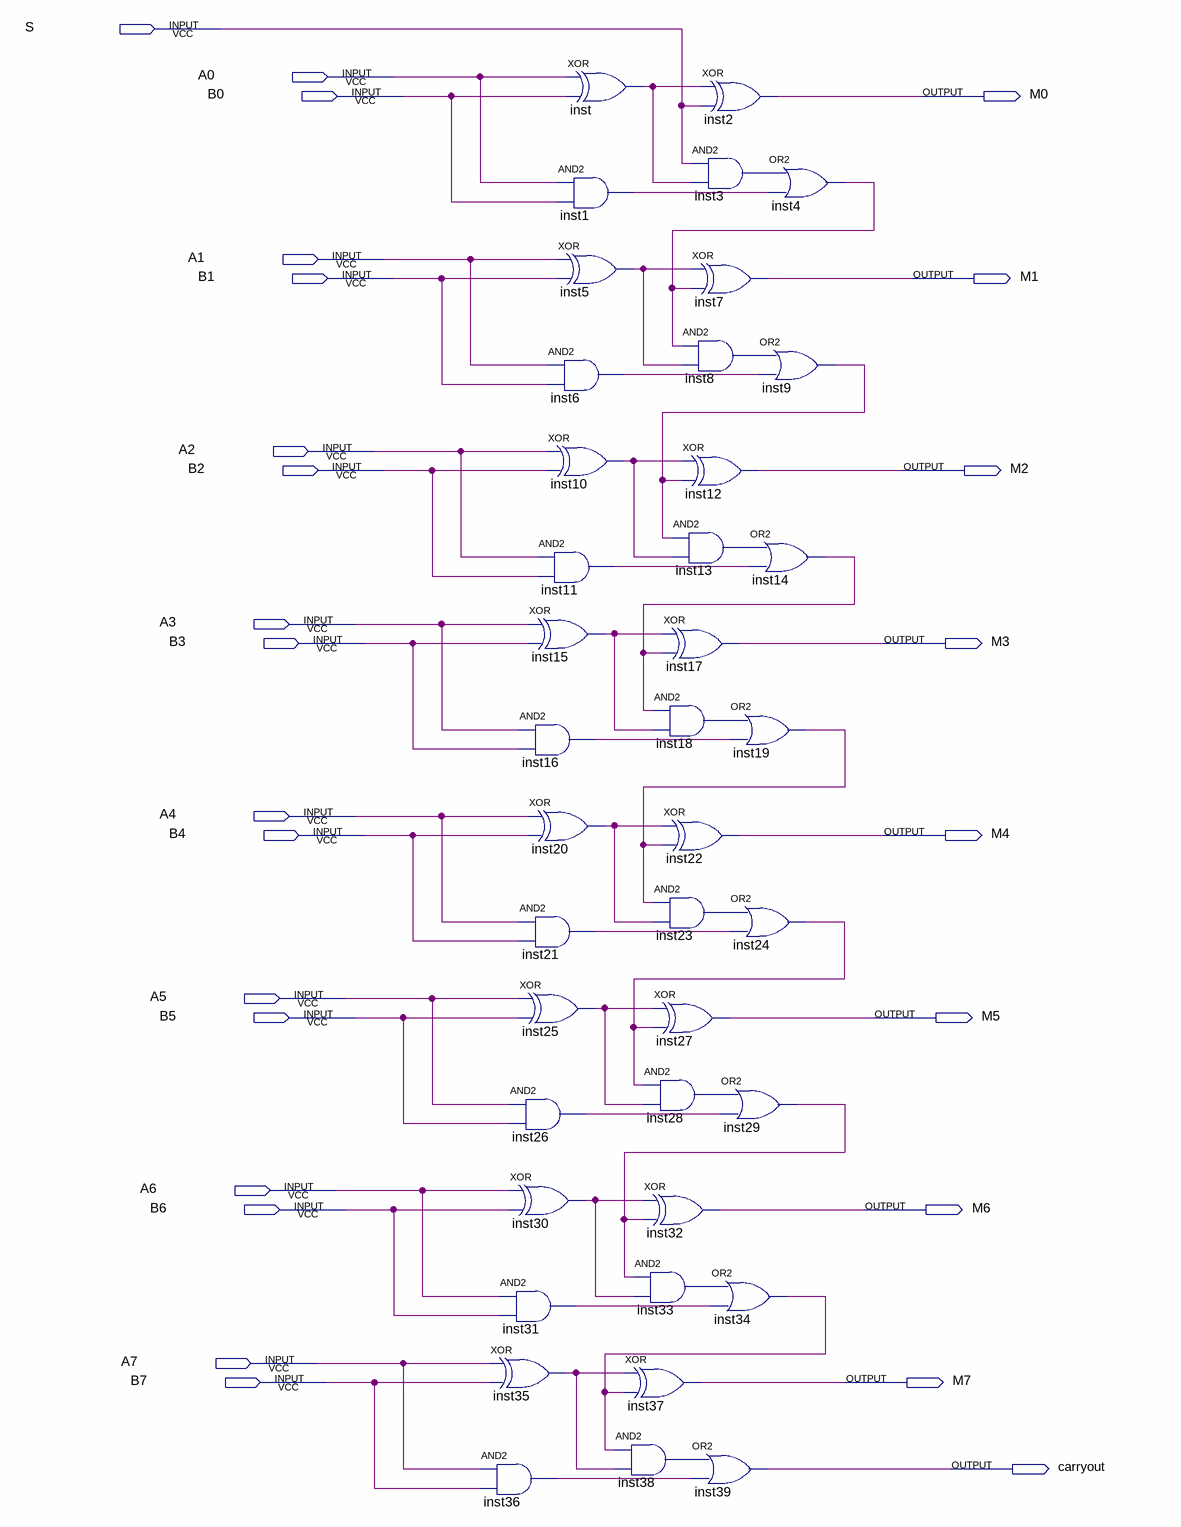
[diagram p0: schematic sheet]
// Quartus schematic adder.bdf as structural Verilog: 40 symbols, 26 pins
module adder (
  input  S,
  input  A0,
  input  B0,
  input  A1,
  input  B1,
  input  A2,
  input  B2,
  input  A3,
  input  B3,
  input  A4,
  input  B4,
  input  A5,
  input  B5,
  input  A6,
  input  B6,
  input  A7,
  input  B7,
  output M0,
  output M1,
  output M2,
  output M3,
  output M4,
  output M5,
  output M6,
  output M7,
  output carryout
);

  wire inst1_out, inst3_out, inst4_out, inst5_out, inst6_out, inst8_out, inst9_out, inst10_out, inst11_out,
       inst13_out, inst14_out, inst15_out, inst16_out, inst18_out, inst19_out, inst20_out, inst21_out,
       inst23_out, inst24_out, inst25_out, inst26_out, inst28_out, inst29_out, inst30_out, inst31_out,
       inst33_out, inst34_out, inst35_out, inst36_out, inst38_out, inst_out;

  and inst36 (inst36_out, A7, B7);
  and inst1 (inst1_out, A0, B0);
  xor inst5 (inst5_out, A1, B1);
  and inst6 (inst6_out, A1, B1);
  xor inst10 (inst10_out, A2, B2);
  and inst11 (inst11_out, A2, B2);
  xor inst15 (inst15_out, A3, B3);
  and inst16 (inst16_out, A3, B3);
  xor inst20 (inst20_out, A4, B4);
  and inst21 (inst21_out, A4, B4);
  xor inst25 (inst25_out, A5, B5);
  and inst26 (inst26_out, A5, B5);
  xor inst30 (inst30_out, A6, B6);
  and inst31 (inst31_out, A6, B6);
  xor inst35 (inst35_out, A7, B7);
  xor inst (inst_out, A0, B0);
  and inst33 (inst33_out, inst29_out, inst30_out);
  xor inst37 (M7, inst35_out, inst34_out);
  and inst38 (inst38_out, inst34_out, inst35_out);
  xor inst2 (M0, inst_out, S);
  and inst3 (inst3_out, S, inst_out);
  xor inst7 (M1, inst5_out, inst4_out);
  and inst8 (inst8_out, inst4_out, inst5_out);
  xor inst12 (M2, inst10_out, inst9_out);
  and inst13 (inst13_out, inst9_out, inst10_out);
  xor inst17 (M3, inst15_out, inst14_out);
  and inst18 (inst18_out, inst14_out, inst15_out);
  xor inst22 (M4, inst20_out, inst19_out);
  and inst23 (inst23_out, inst19_out, inst20_out);
  xor inst27 (M5, inst25_out, inst24_out);
  and inst28 (inst28_out, inst24_out, inst25_out);
  xor inst32 (M6, inst30_out, inst29_out);
  or inst34 (inst34_out, inst33_out, inst31_out);
  or inst39 (carryout, inst38_out, inst36_out);
  or inst4 (inst4_out, inst3_out, inst1_out);
  or inst9 (inst9_out, inst8_out, inst6_out);
  or inst14 (inst14_out, inst13_out, inst11_out);
  or inst19 (inst19_out, inst18_out, inst16_out);
  or inst24 (inst24_out, inst23_out, inst21_out);
  or inst29 (inst29_out, inst28_out, inst26_out);
endmodule
